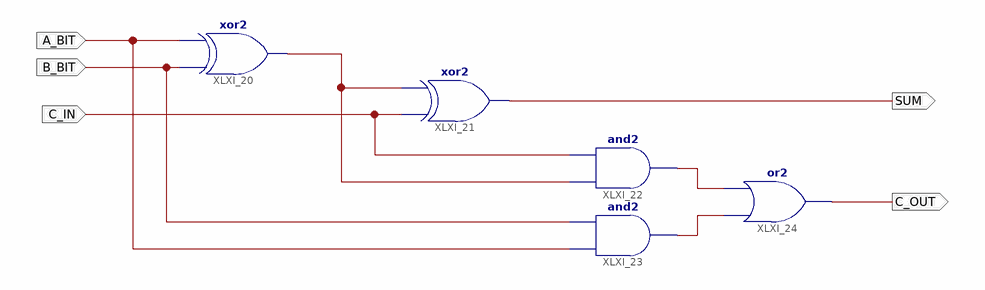
[diagram p0: schematic sheet 1]
// Xilinx ISE schematic FullAdder.sch (spartan6) as structural Verilog: 5 symbols, 5 ports
module FullAdder (
  input  C_IN,
  input  A_BIT,
  input  B_BIT,
  output SUM,
  output C_OUT
);

  wire XLXN_7, XLXN_15, XLXN_16;

  xor XLXI_21 (SUM, C_IN, XLXN_7);
  and XLXI_22 (XLXN_15, XLXN_7, C_IN);
  and XLXI_23 (XLXN_16, A_BIT, B_BIT);
  or XLXI_24 (C_OUT, XLXN_16, XLXN_15);
  xor XLXI_20 (XLXN_7, B_BIT, A_BIT);
endmodule
